# EAGLE design soundboard-qtpy-bff-v01 (EAGLE 7.7.0)
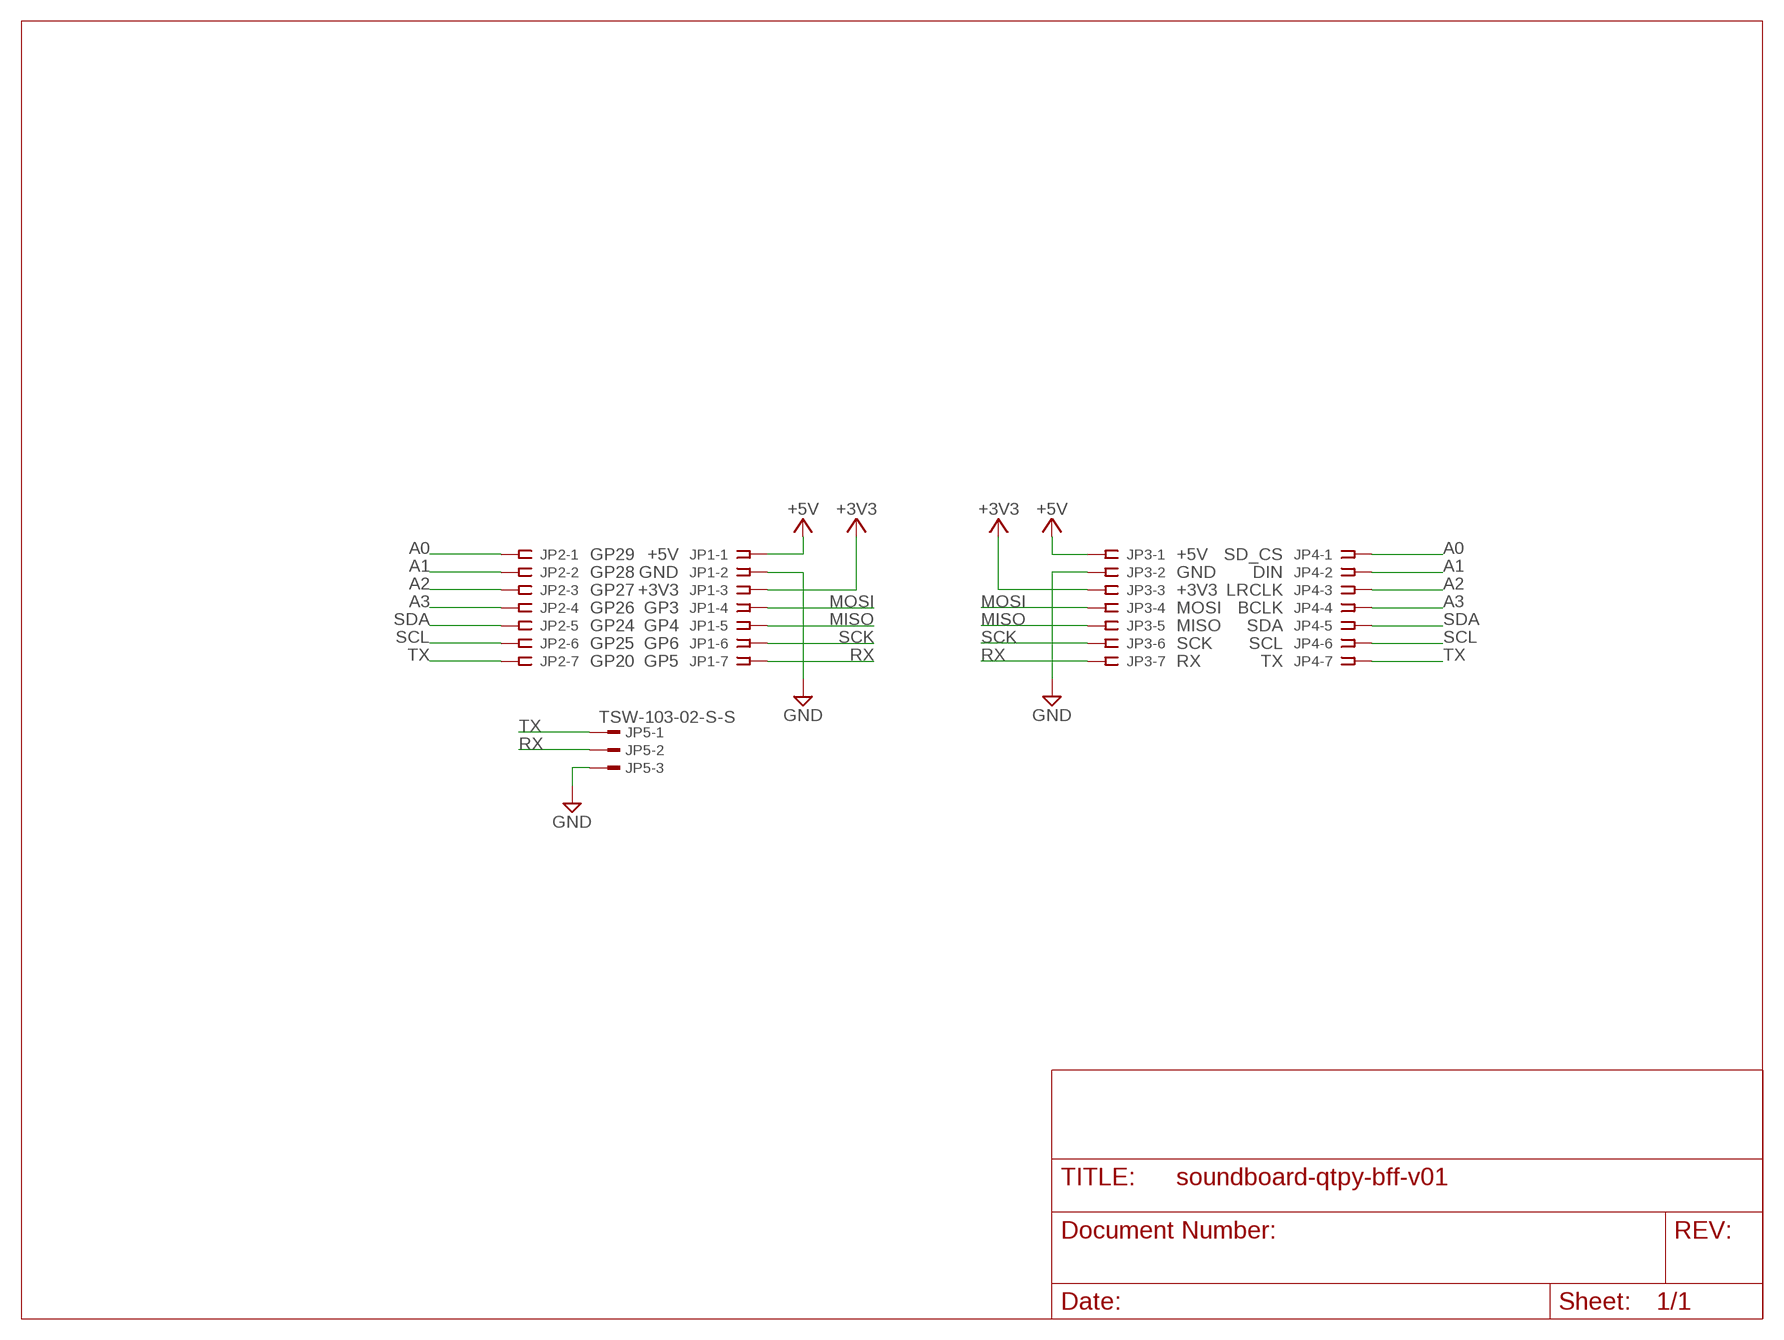
[diagram p0: schematic, sheet 1]

## Parts
JP1  SSW-107-02-S-S  [SSW-107-02-S-S]
JP2  SSW-107-02-S-S  [SSW-107-02-S-S]
JP3  SSW-107-02-S-S  [SSW-107-02-S-S]
JP4  SSW-107-02-S-S  [SSW-107-02-S-S]
JP5  TSW-103-02-S-S  [TSW-103-02-S-S]

## Nets
+3V3: JP1.3 JP3.3
+5V: JP1.1 JP3.1
A0: JP2.1 JP4.1
A1: JP2.2 JP4.2
A2: JP2.3 JP4.3
A3: JP2.4 JP4.4
GND: JP1.2 JP3.2 JP5.3
MISO: JP1.5 JP3.5
MOSI: JP1.4 JP3.4
RX: JP1.7 JP3.7 JP5.2
SCK: JP1.6 JP3.6
SCL: JP2.6 JP4.6
SDA: JP2.5 JP4.5
TX: JP2.7 JP4.7 JP5.1

## Notes on the sheet
- GP29 | +5V | +5V | SD_CS
- GP28 | GND | GND | DIN
- GP27 | +3V3 | +3V3 | LRCLK
- GP26 | GP3 | MOSI | BCLK
- GP24 | GP4 | MISO | SDA
- GP25 | GP6 | SCK | SCL
- GP20 | GP5 | RX | TX

## Library data of the parts
JP1-JP4 = con-samtec:SSW-107-02-S-S: THROUGH-HOLE .025" SQ POST SOCKET Source: Samtec SSW.pdf; MPN: SSW-107-02-S-S; OC_FARNELL: unknown; OC_NEWARK: 11P9433
JP5 = con-samtec:TSW-103-02-S-S: THROUGH-HOLE .025" SQ POST HEADER Source: Samtec TSW.pdf; OC_FARNELL: unknown; OC_NEWARK: unknown

## Board
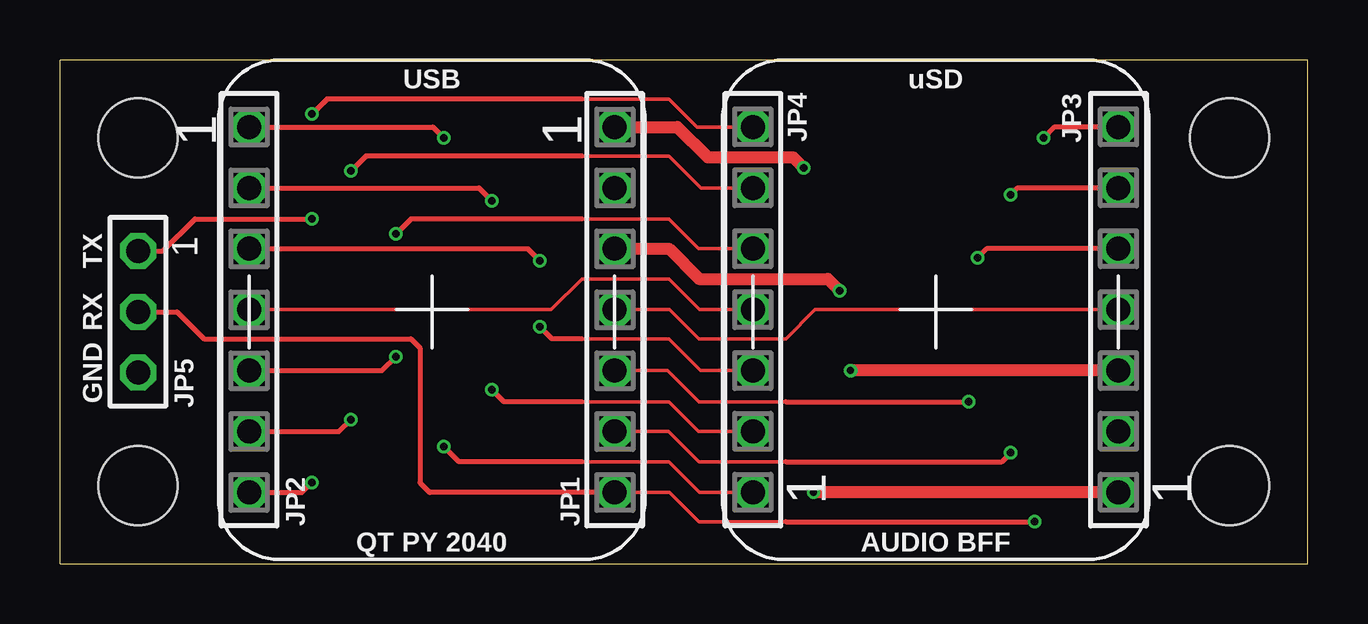
[diagram p1: board, top side]
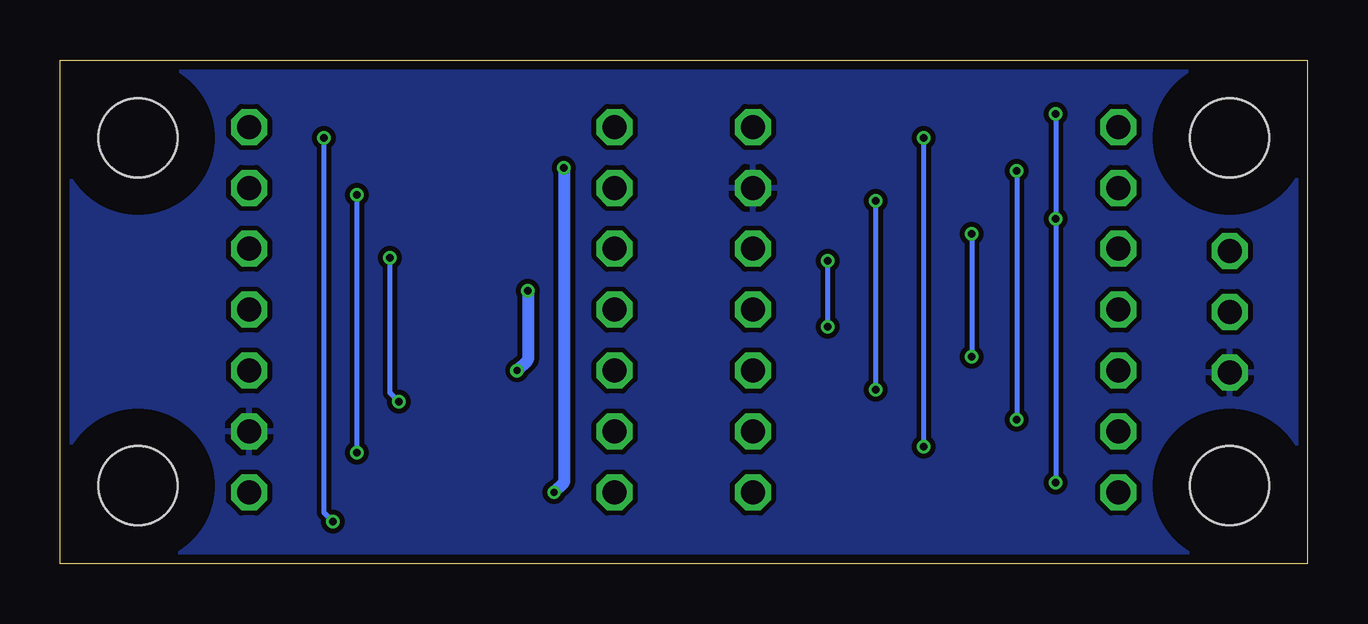
[diagram p2: board, bottom side, seen from below]

Size 52 x 21 mm. Coordinates in mm from the lower left corner, seen from the top.
Outline: 0,0 52,0 52,21 0,21 0,0
Copper layers (1*16): Top 0.035559375mm / dielectric 1.6mm / Bottom 0.035559375mm
Design rules "oshpark-2layer-2018": minimum track width 6mil, minimum drill 10mil, track to track 6mil, track to pad 6mil, pad to pad 6mil, via to via 6mil, smd to smd 6mil, copper to edge 15mil, drill to drill 6mil, minimum pad ring 5mil, minimum via ring 5mil, stop-mask expansion 2.5mil, vias tented up to drill 0mil, thermal gap 10mil
Holes 3.3 mm at 3.25,17.75 48.75,17.75 3.25,3.25 48.75,3.25
tKeepout: area 0.2,14.8 to 6.2,20.8; area 45.8,14.8 to 51.8,20.8; area 0.2,0.2 to 6.2,6.2; area 45.8,0.2 to 51.8,6.2
bRestrict: area 0.2,14.8 to 6.2,20.8; area 45.8,14.8 to 51.8,20.8; area 0.2,0.2 to 6.2,6.2; area 45.8,0.2 to 51.8,6.2

### Footprints (pad centres in the part's own frame; a part is rotated, then mirrored left to right if it is on the bottom)
SSW-107-02-S-S = drill 1 pad 1.5 octagon: 1 -7.62,0; 2 -5.08,0; 3 -2.54,0; 4 0,0; 5 2.54,0; 6 5.08,0; 7 7.62,0
TSW-103-02-S-S = drill 1 pad 1.5 octagon: 1 2.54,0; 2 0,0; 3 -2.54,0

### Placement (x,y rotation side)
JP1  23.12,10.59 270 top
JP2  7.88,10.59 270 top
JP3  44.12,10.59 90 top
JP4  28.88,10.59 90 top
JP5  3.25,10.5 90 top

### Tracks (layer width: path | path; a pad name or v marks a point on that pad's centre or on a via)
+3V3  (via drill 0.3)
  Top 0.508: JP1.3 25.38,13.13 26.62,11.88 32,11.88 v32.5,11.38 | JP3.3 v32.95,8.05
  Bottom 0.508: v32.5,11.38 32.5,8.5 v32.95,8.05
+5V  (via drill 0.3)
  Top 0.508: JP1.1 25.73,18.21 27,16.94 30.56,16.94 v31,16.5 | JP3.1 v31.41,2.97
  Bottom 0.508: v31,16.5 31,3.38 v31.41,2.97
A0  (via drill 0.3)
  Top 0.152: JP4.1 26.66,2.97 25.38,4.25 21.75,4.25
  Top 0.203: 21.75,4.25 16.62,4.25 v16,4.88 | v16,17.75 15.54,18.21 JP2.1
  Bottom 0.203: v16,4.88 v16,17.75
A1  (via drill 0.3)
  Top 0.152: JP4.2 26.62,5.51 25.38,6.75 21.75,6.75
  Top 0.203: 21.75,6.75 18.5,6.75 v18,7.25 | v18,15.12 17.46,15.67 JP2.2
  Bottom 0.203: v18,7.25 v18,15.12
A2  (via drill 0.3)
  Top 0.152: JP4.3 26.7,8.05 25.38,9.38 21.75,9.38
  Top 0.203: 21.75,9.38 20.5,9.38 v20,9.88 | v20,12.62 19.5,13.13 JP2.3
  Bottom 0.203: v20,9.88 v20,12.62
A3
  Top 0.152: JP4.4 26.66,10.59 25.38,11.88 21.75,11.88 20.46,10.59 JP2.4
GND
  pour Bottom (isolate 0.203): 0,0 52,0 52,21 0,21
MISO  (via drill 0.3)
  Top 0.152: JP1.5 25.33,8.05 26.62,6.75 30.25,6.75
  Top 0.203: 30.25,6.75 v37.88,6.75 | v38.25,12.75 38.63,13.13 JP3.5
  Bottom 0.203: v37.88,6.75 38.25,7.12 v38.25,12.75
MOSI
  Top 0.152: JP1.4 25.41,10.59 26.62,9.38 30.25,9.38 31.46,10.59 JP3.4
RX  (via drill 0.3)
  Top 0.152: JP1.7 25.41,2.97 26.62,1.75 30.25,1.75
  Top 0.203: 30.25,1.75 v40.62,1.75 | v41,17.75 41.46,18.21 JP3.7 | JP5.2 4.88,10.5 6,9.38 14.62,9.38 15,9 15,3.38 15.41,2.97 JP1.7
  Bottom 0.203: v40.62,1.75 41,2.12 v41,17.75
SCK  (via drill 0.3)
  Top 0.152: JP1.6 25.37,5.51 26.62,4.25 30.25,4.25
  Top 0.203: 30.25,4.25 39.25,4.25 v39.62,4.62 | v39.62,15.38 39.92,15.67 JP3.6
  Bottom 0.203: v39.62,4.62 v39.62,15.38
SCL  (via drill 0.3)
  Top 0.152: JP4.6 26.71,15.67 25.38,17 21.75,17
  Top 0.203: 21.75,17 12.75,17 v12.12,16.38 | v12.12,6 11.63,5.51 JP2.6
  Bottom 0.203: v12.12,16.38 v12.12,6
SDA  (via drill 0.3)
  Top 0.152: JP4.5 26.62,13.13 25.38,14.38 21.75,14.38
  Top 0.203: 21.75,14.38 14.62,14.38 v14,13.75 | v14,8.62 13.42,8.05 JP2.5
  Bottom 0.203: v14,13.75 v14,8.62
TX  (via drill 0.3)
  Top 0.152: JP4.7 26.54,18.21 25.38,19.38 21.75,19.38
  Top 0.203: 21.75,19.38 11.12,19.38 v10.5,18.75 | v10.5,3.38 10.09,2.97 JP2.7 | JP5.1 4.29,13.04 5.62,14.38 v10.5,14.38
  Bottom 0.203: v10.5,18.75 v10.5,14.38 v10.5,3.38

### Text on the board
_tsilk: USB | uSD | TX | RX | GND | QT PY 2040 | AUDIO BFF